# EAGLE design ac_proj (EAGLE 9.6.2)
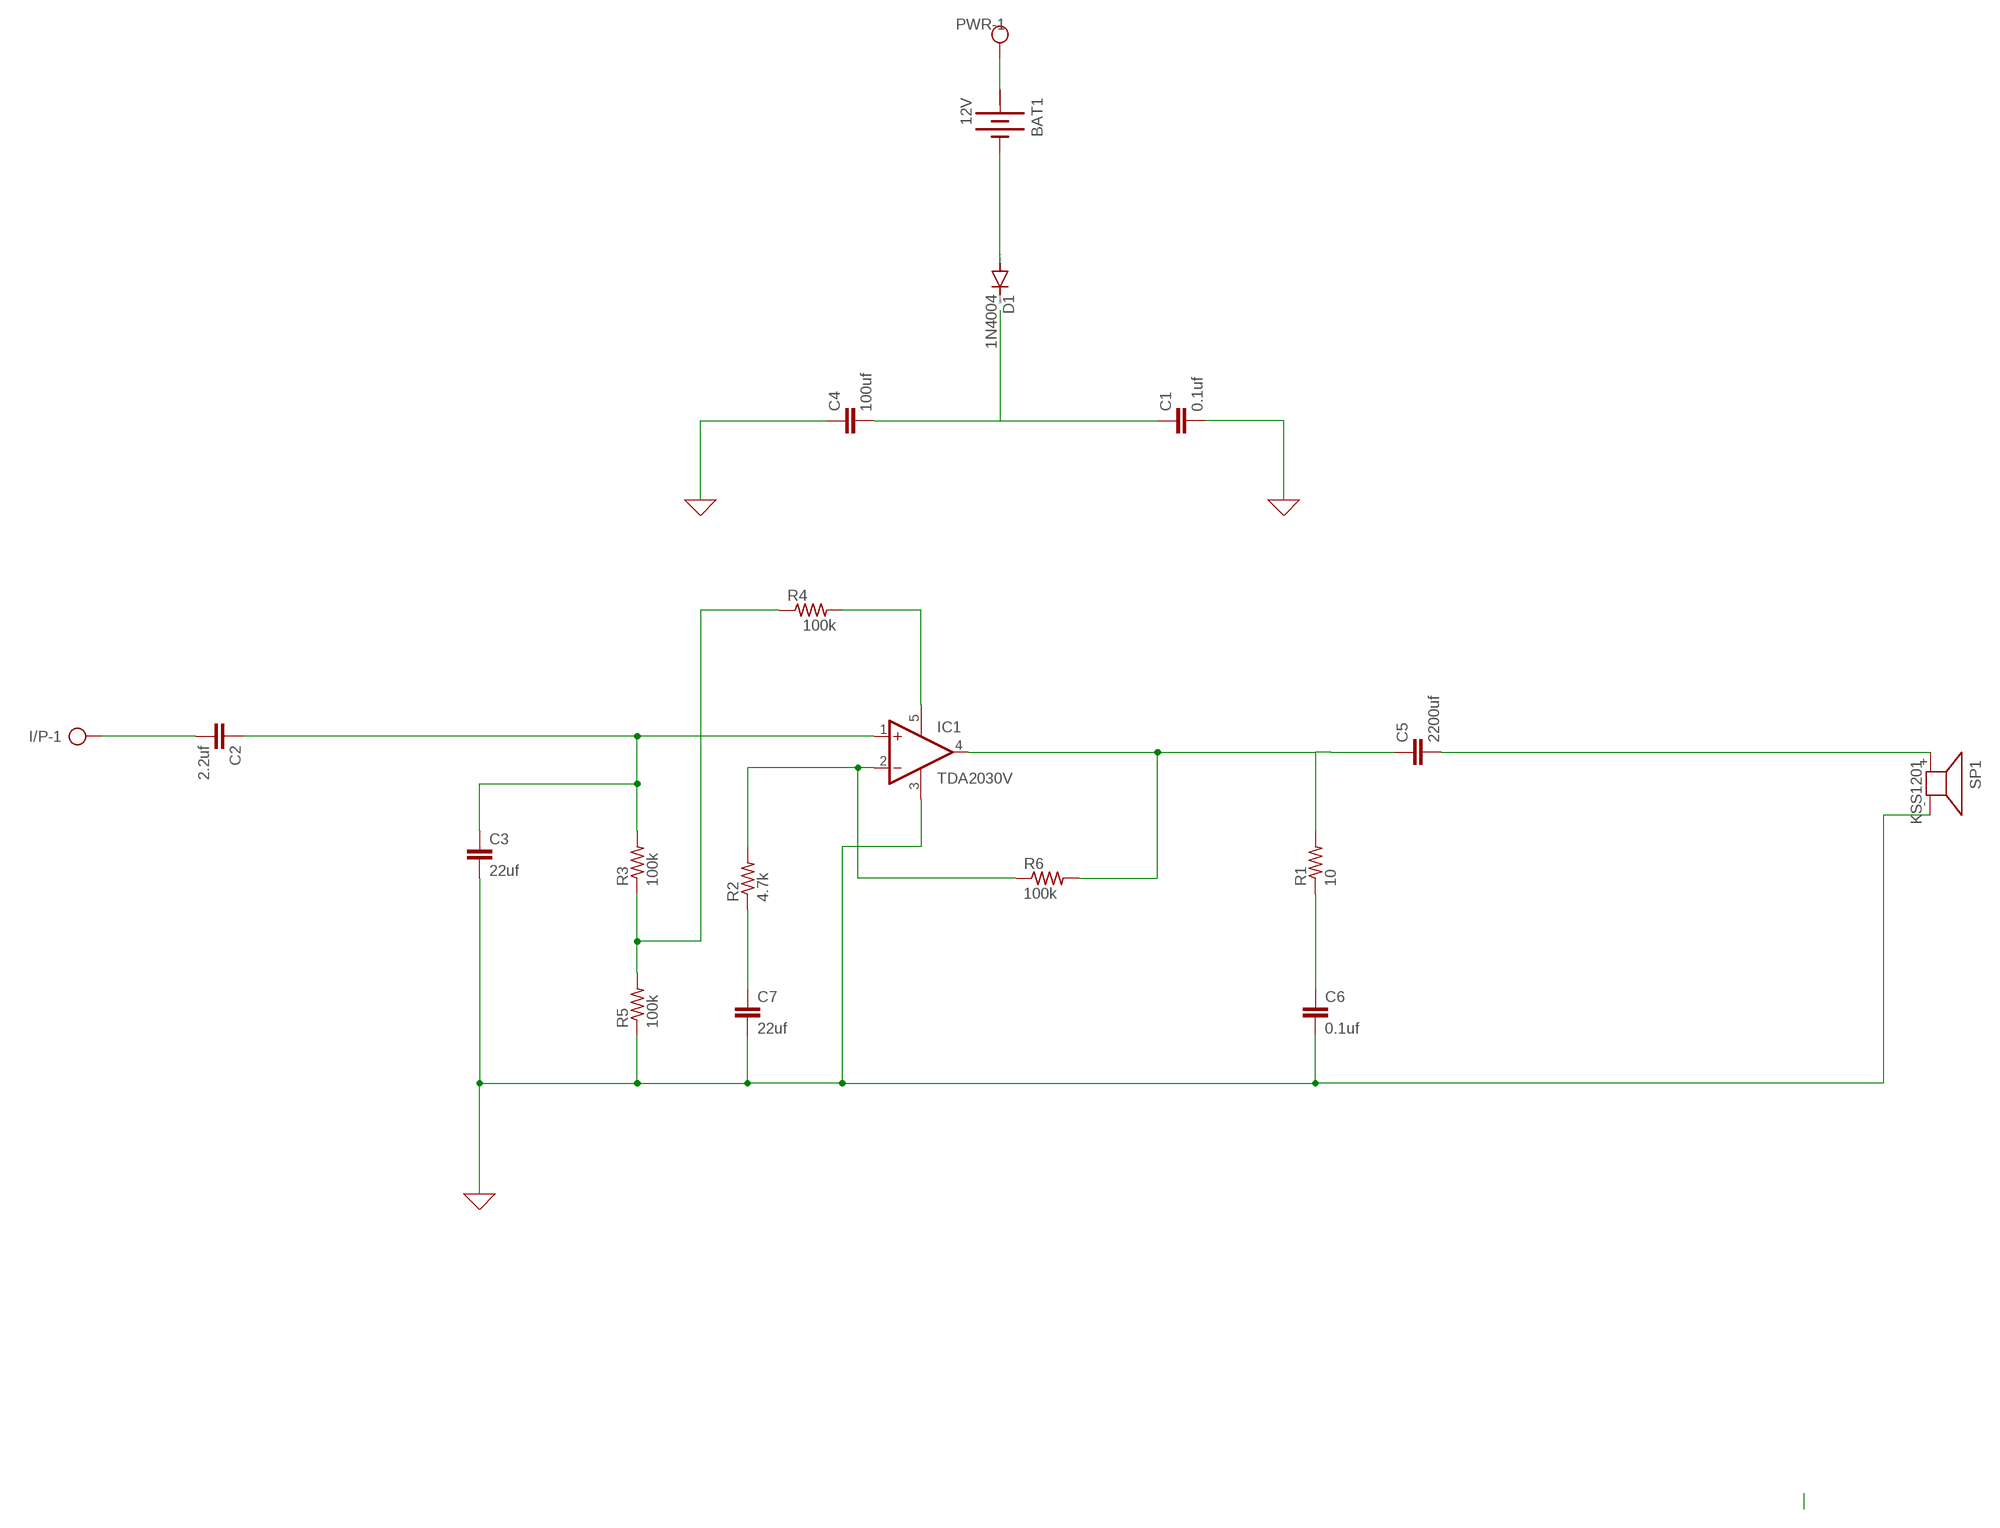
[diagram p0: schematic, sheet 1]

## Parts
BAT1  12V  BATTERY  [BATTERY]
C1  0.1uf  C5/3  [C5B3]
C2  2.2uf  C5/3  [C5B3]
C3  22uf  C5/3  [C5B3]
C4  100uf  C5/3  [C5B3]
C5  2200uf  C5/3  [C5B3]
C6  0.1uf  C5/3  [C5B3]
C7  22uf  C5/3  [C5B3]
D1  1N4004  [DO41-10]
I/P  AK500/2-H  [AK500/2-H]
IC1  TDA2030V  [CB360]
PWR  AK500/2-H  [AK500/2-H]
R1  10  R-US_0411/15  [0411/15]
R2  4.7k  R-US_0411/15  [0411/15]
R3  100k  R-US_0411/15  [0411/15]
R4  100k  R-US_0411/15  [0411/15]
R5  100k  R-US_0411/15  [0411/15]
R6  100k  R-US_0411/15  [0411/15]
SP1  KSS1201  [KSS1201]

## Nets
0: C1.2 C3.2 C4.1 C6.2 C7.2 IC1.3(GND) R5.1 SP1.- ; supply symbol labelled GND
N$1: C2.1 C3.1 IC1.1(+IN) R3.2
N$2: R3.1 R4.1 R5.2
N$3: C2.2 I/P.1
N$4: C1.1 C4.2
N$5: IC1.5(V+) R4.2
N$6: BAT1.- D1.A
N$7: BAT1.+ PWR.1
N$8: IC1.2(-IN) R2.2 R6.1
N$9: C7.1 R2.1
N$10: C5.1 IC1.4(OUT) R1.2 R6.2
N$11: C5.2 SP1.+
N$12: C6.1 R1.1
Unconnected: D1.C I/P.2 PWR.2

## Power pins joined to a net without a drawn wire
+: BAT1.+@1(+)

## Library data of the parts
BAT1 = special:BATTERY: BATTERY
C1-C7 = capacitor-wima:C: CAPACITOR naming: grid - package width
D1 = diode:1N4004: DIODE general purpose rectifier, 1 A
I/P PWR = con-ptr500:AK500/2-H: CONNECTOR Aug. 2004 / PTR Meßtechnik: Die Bezeichnung der Serie AK505 wurde geändert. Es handelt sich hierbei um AK500 in horizontaler Ausführung.; OC_FARNELL: unknown; OC_NEWARK: unknown
IC1 = linear:TDA2030: Power OP AMP
R1-R6 = rcl:R-US_: RESISTOR, American symbol; SPICEPREFIX: R
SP1 = buzzer:KSS1201: SPEAKER Source: Schukat; OC_FARNELL: unknown; OC_NEWARK: unknown

## Board
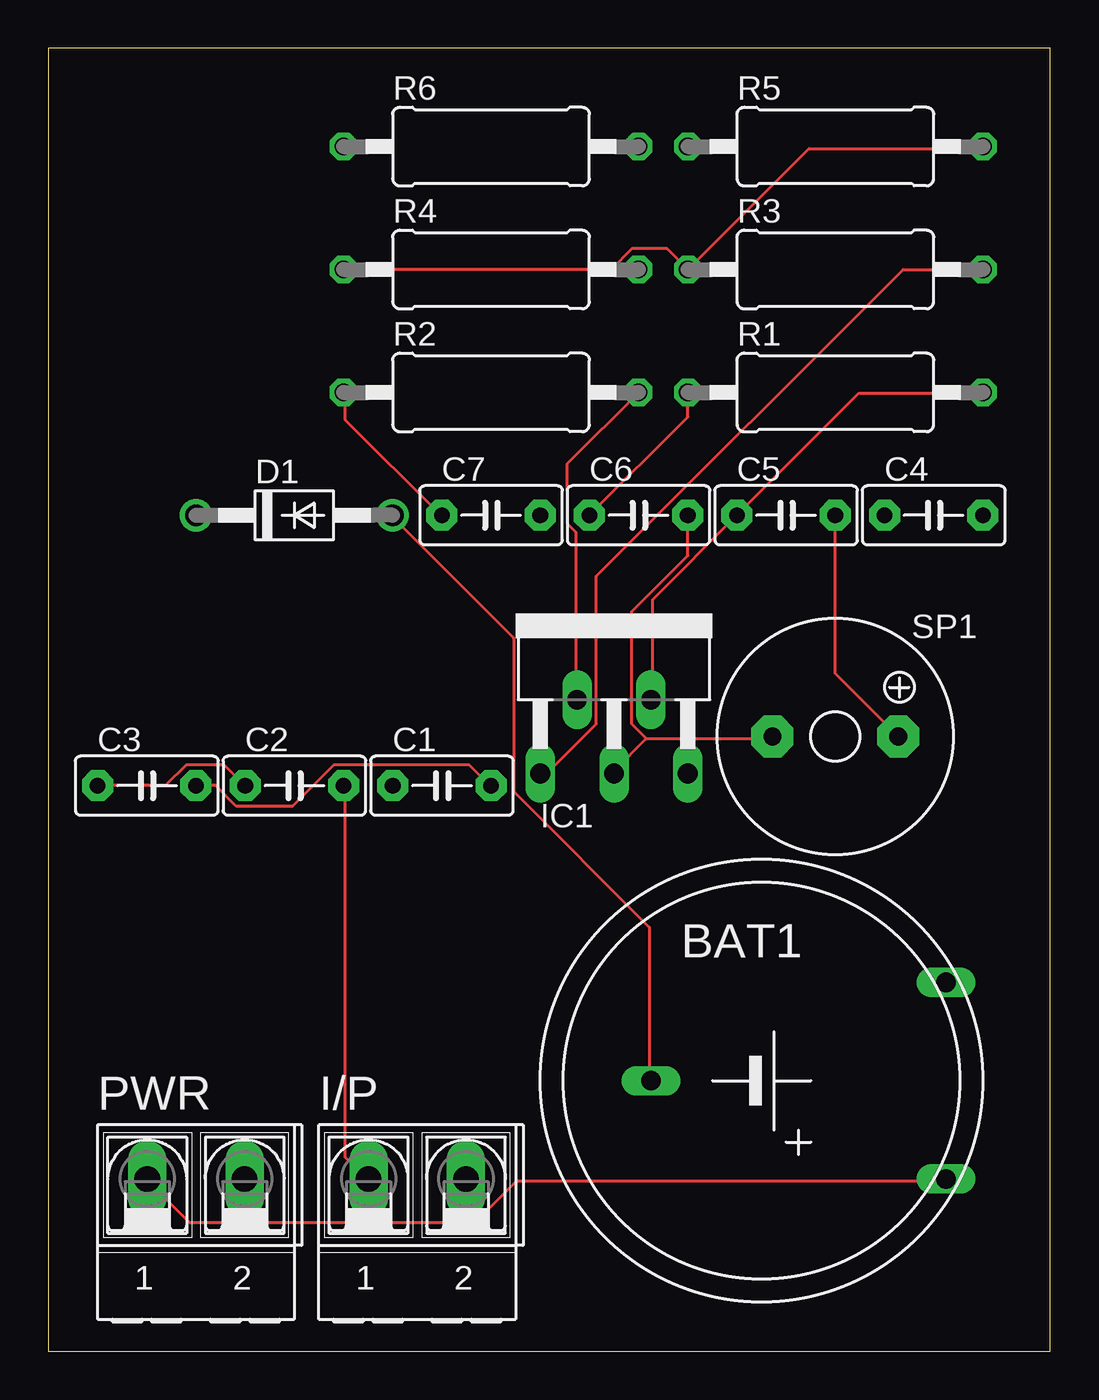
[diagram p1: board, top side]
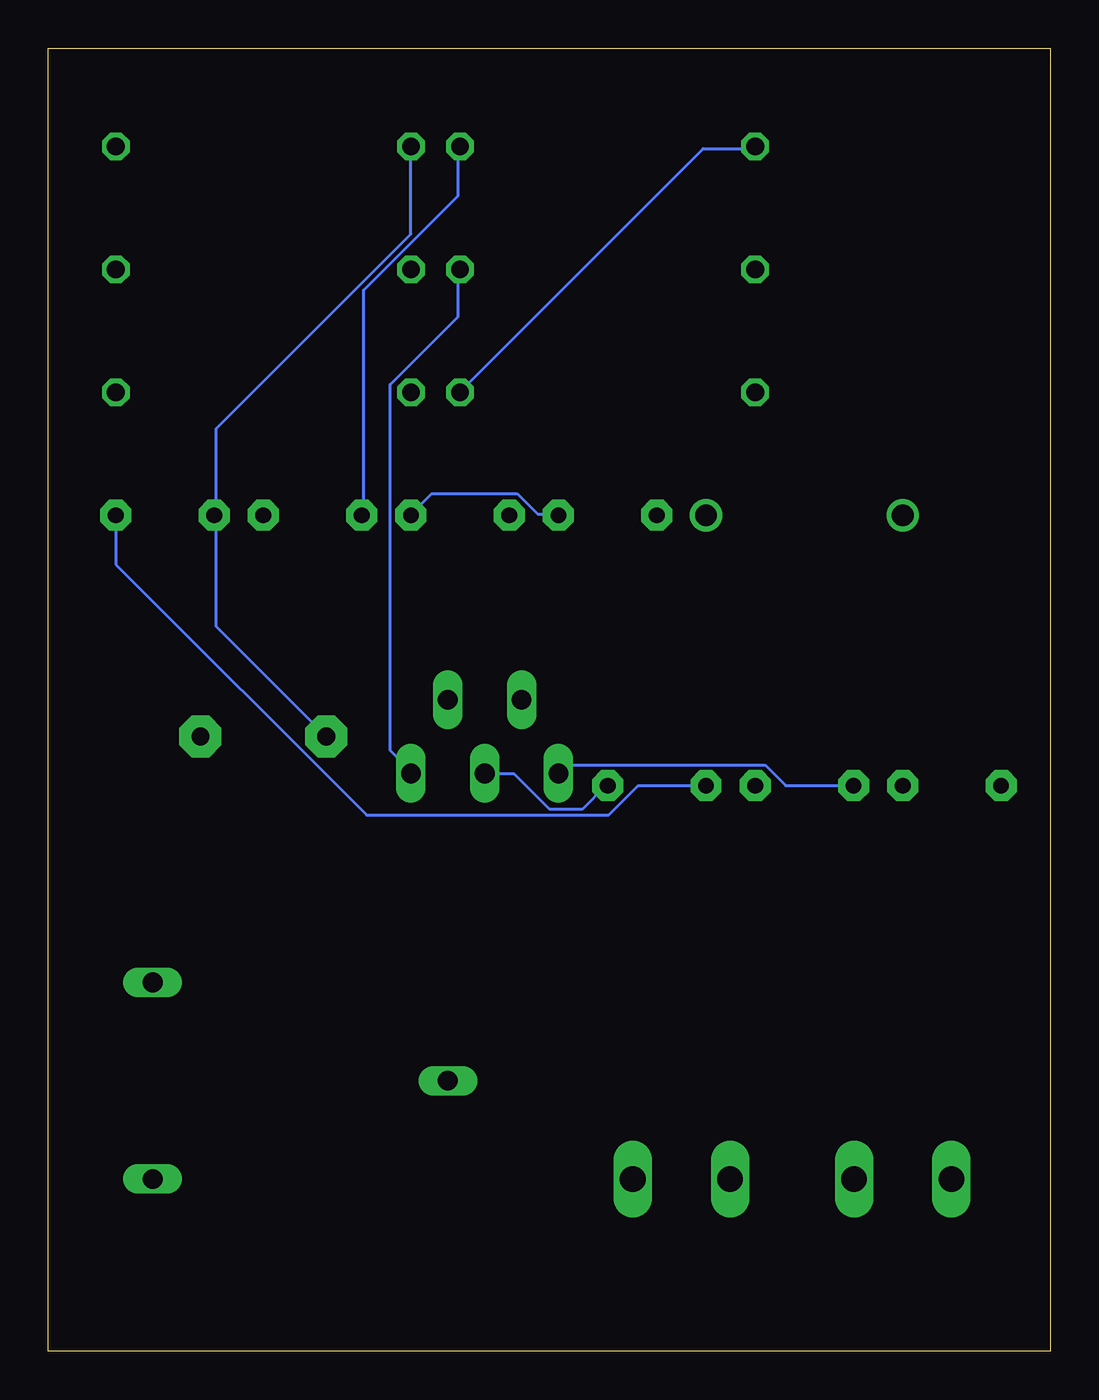
[diagram p2: board, bottom side, seen from below]

Size 51.74 x 67.3 mm. Coordinates in mm from the lower left corner, seen from the top.
Outline: 0,0 51.74,0 51.74,67.3 0,67.3 0,0
Copper layers (1*16): Top 0.035mm / dielectric 1.5mm / Bottom 0.035mm
Design rules "default": minimum track width 6mil, minimum drill 0.35mm, track to track 6mil, track to pad 6mil, pad to pad 6mil, via to via 6mil, smd to smd 6mil, copper to edge 40mil, drill to drill 6mil, minimum pad ring 10mil, minimum via ring 8mil, stop-mask expansion 4mil, vias tented up to drill 0mil, thermal gap 10mil

### Footprints (pad centres in the part's own frame; a part is rotated, then mirrored left to right if it is on the bottom)
BATTERY = drill 1.016 long: + 9.525,-5.08; +@1 9.525,5.08; - -5.715,0
C5B3 = drill 0.813 pad 1.6 octagon: 1 -2.54,0; 2 2.54,0
DO41-10 = drill 1.118: A 5.08,0; C -5.08,0
AK500/2-H = drill 1.321 long: 1 -2.515,0; 2 2.515,0
CB360 = drill 1.016 long: 1 -3.81,-8.255; 2 -1.905,-4.445; 3 0,-8.255; 4 1.905,-4.445; 5 3.81,-8.255
0411/15 = drill 0.914 octagon: 1 -7.62,0; 2 7.62,0
KSS1201 = drill 0.914 pad 2.159 octagon: + 3.251,0; - -3.251,0

### Placement (x,y rotation side)
BAT1  36.83,13.97 0 top
C1  20.32,29.21 0 top
C2  12.7,29.21 0 top
C3  5.08,29.21 0 top
C4  45.72,43.18 0 top
C5  38.1,43.18 0 top
C6  30.48,43.18 0 top
C7  22.86,43.18 0 top
D1  12.7,43.18 0 top
I/P  19.05,8.89 0 top
IC1  29.21,38.1 0 top
PWR  7.62,8.89 0 top
R1  40.64,49.53 0 top
R2  22.86,49.53 0 top
R3  40.64,55.88 0 top
R4  22.86,55.88 0 top
R5  40.64,62.23 0 top
R6  22.86,62.23 0 top
SP1  40.64,31.75 0 top

### Tracks (layer width: path | path; a pad name or v marks a point on that pad's centre or on a via)
0
  Top 0.152: C3.2 8.64,29.21 9.7,28.14 12.6,28.14 14.73,30.28 21.74,30.28 22.81,29.21 C1.2 | 30.89,31.65 37.29,31.65 SP1.- | 30.89,31.65 29.21,29.97 IC1.3 | C6.2 33.02,41.1 30.12,38.2 30.12,32.41 30.89,31.65
  Bottom 0.152: R5.1 33.02,57.71 43.08,47.65 43.08,43.23 C4.1 43.08,43.08 43.08,37.44 SP1.- | C7.2 25.4,43.23 26.47,43.23 27.53,44.3 31.95,44.3 33.02,43.23 C6.2 | IC1.3 29.21,29.82 27.69,29.82 25.86,27.99 24.18,27.99 22.96,29.21 C1.2
N$1
  Top 0.152: C3.1 6.04,29.21 7.11,30.28 9.09,30.28 C2.1 | R3.2 44.15,55.88 28.3,40.03 28.3,32.41 25.86,29.97 25.4,29.97 IC1.1
  Bottom 0.152: C2.1 13.66,29.21 14.73,30.28 25.09,30.28 25.4,29.97 IC1.1
N$2
  Top 0.152: R4.1 29.06,55.88 30.12,56.95 31.95,56.95 R3.1 39.27,62.13 48.26,62.13 R5.2
N$3
  Top 0.152: C2.2 15.34,29.21 15.34,10.01 16.41,8.94 I/P.1
N$4
  Bottom 0.152: C1.1 21.29,29.21 22.81,27.69 35.31,27.69 48.26,40.64 C4.2
N$5
  Bottom 0.152: R4.2 30.58,55.88 30.58,53.44 34.09,49.94 34.09,31.04 33.02,29.97 IC1.5
N$6
  Top 0.152: BAT1.- 31.04,13.97 31.04,21.89 24.03,28.91 24.03,36.83 17.78,43.08 D1.A
N$7
  Top 0.152: BAT1.+ 46.28,8.79 24.18,8.79 22.05,6.66 7.26,6.66 5.13,8.79 PWR.1
N$8
  Top 0.152: R2.2 26.77,45.82 26.77,42.77 27.23,42.32 27.23,33.78 IC1.2
  Bottom 0.152: R6.1 15.34,62.13 17.93,62.13 30.43,49.63 R2.2
N$9
  Top 0.152: R2.1 15.34,49.48 15.34,48.11 20.22,43.23 C7.1
N$10
  Top 0.152: R1.2 48.26,49.48 41.86,49.48 C5.1 31.19,38.81 31.19,33.78 IC1.4
  Bottom 0.152: R6.2 30.58,62.13 30.58,59.69 35.46,54.81 35.46,43.23 C5.1
N$11
  Top 0.152: C5.2 40.64,35 SP1.+
N$12
  Top 0.152: R1.1 33.02,48.26 C6.1